# Altium schematic sheet Block_Diagram.SchDoc: WİRELESS SECURİTY DETECTOR
size A3; Date: 1/10/2023; CompanyName: ZONGULDAK BÜLENT ECEVİT; Engineer: Alperen ÖZKUL; DocumentNumber: 2; SheetNumber: 2; SheetTotal: 5; FIRST_PROJECT: 1; PAGE_SİZE: *A3
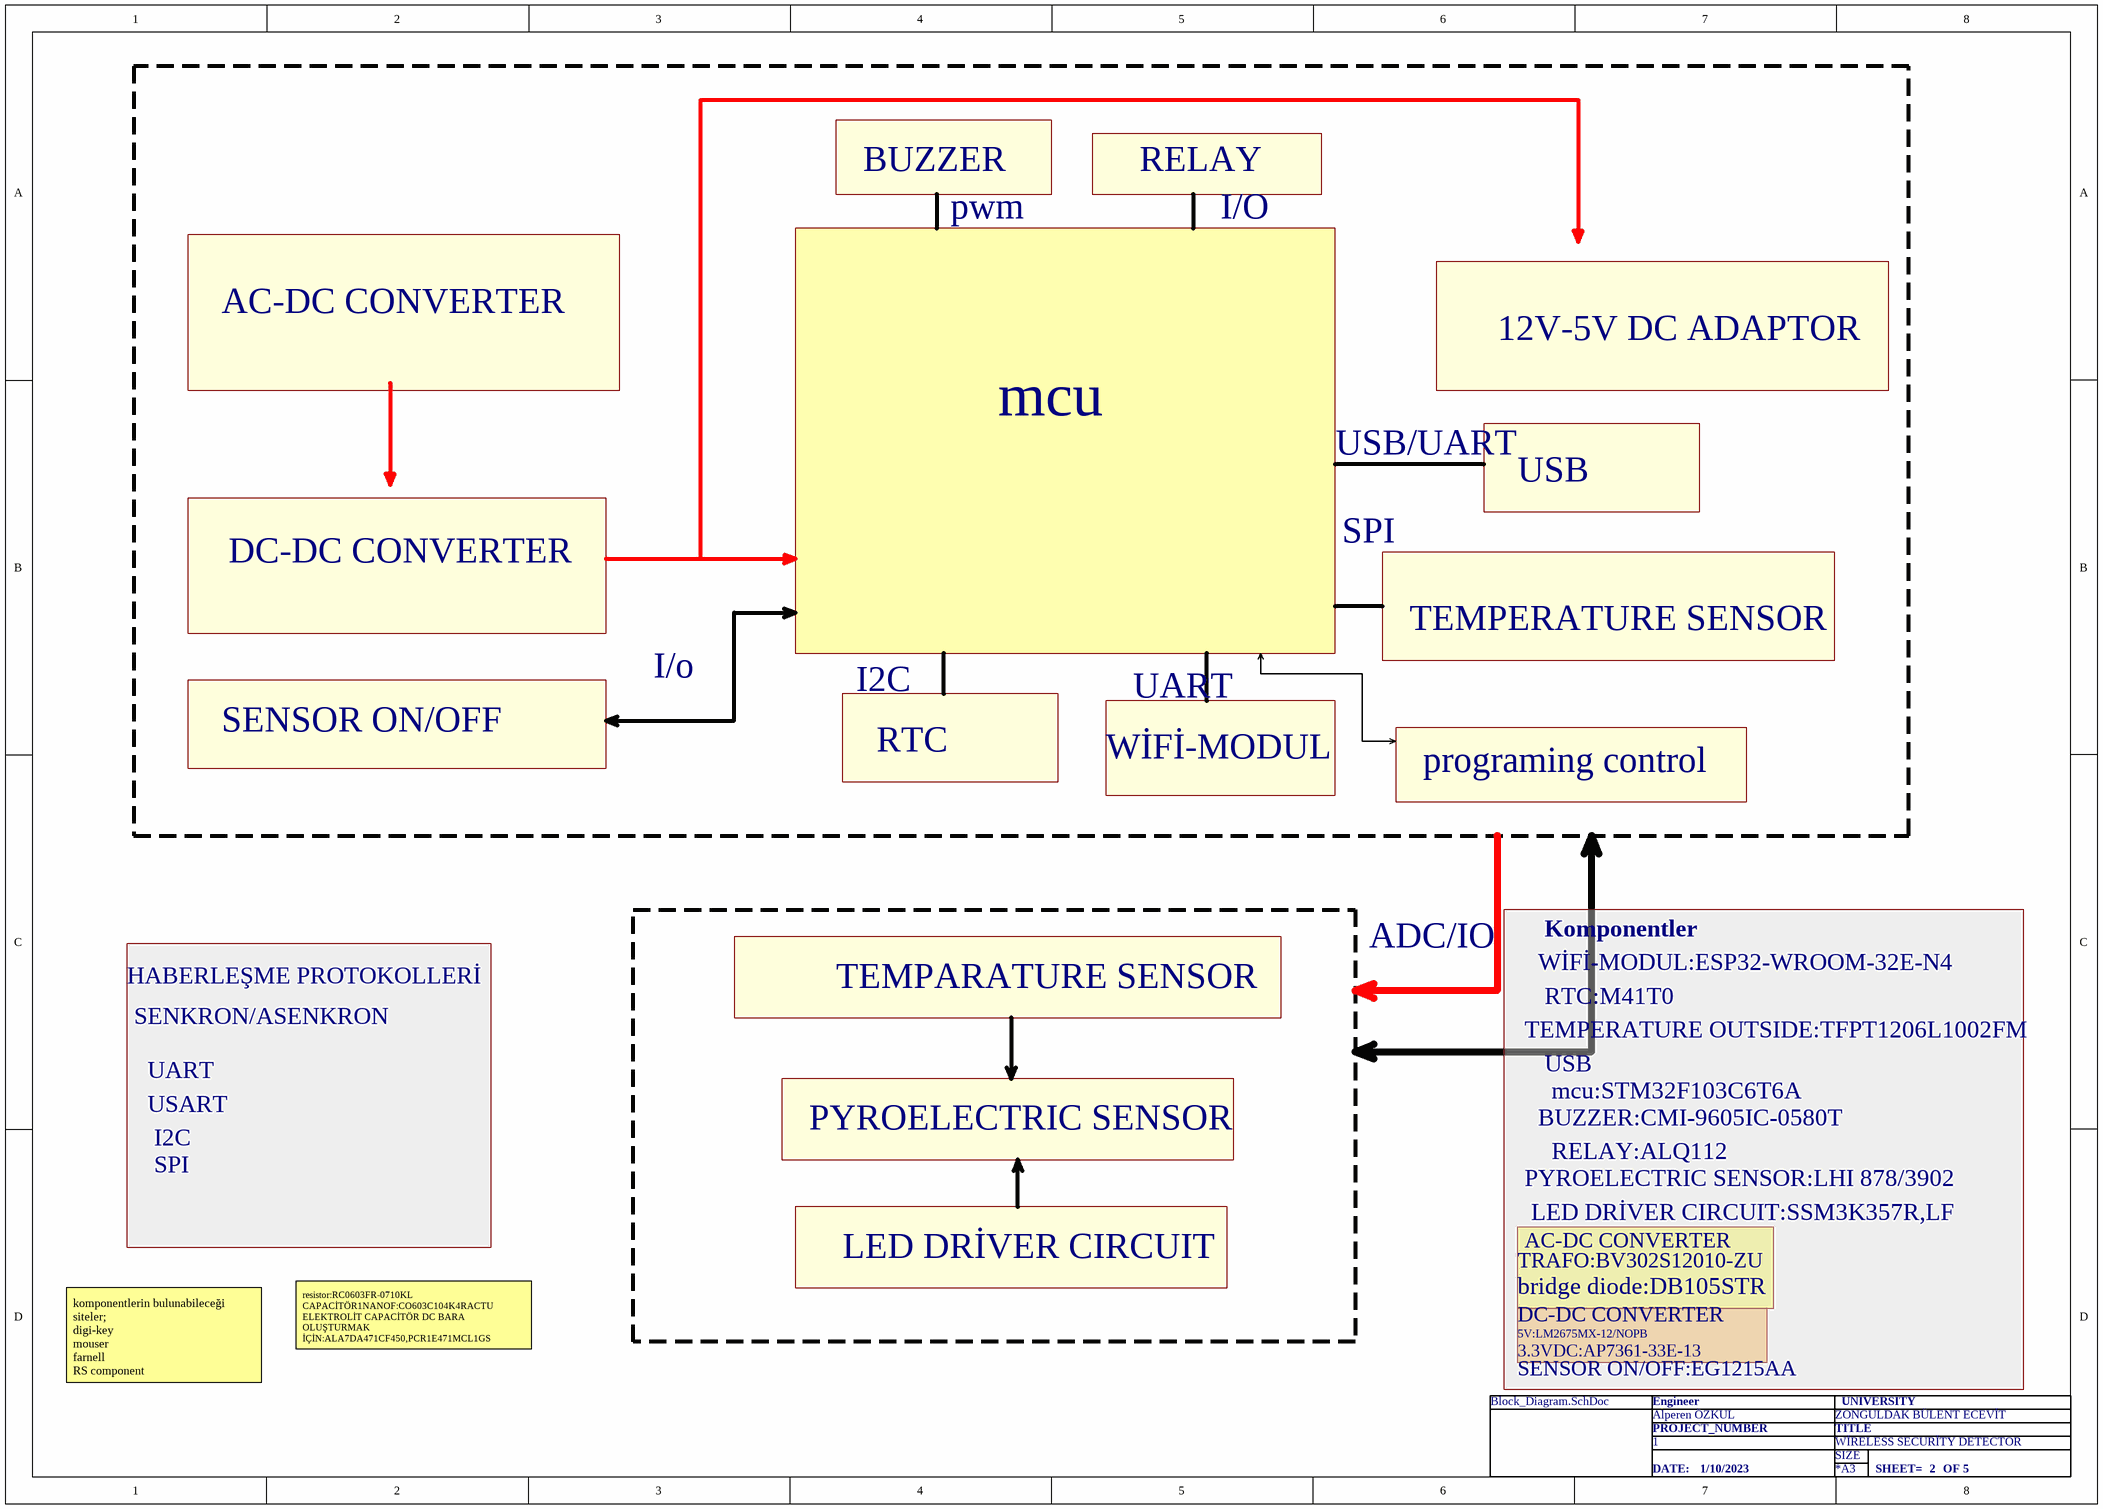
[diagram p0: Block_Diagram.SchDoc]

## Notes on the sheet
- BUZZER
- RELAY
- pwm
- I/O
- AC-DC CONVERTER
- 12V-5V DC ADAPTOR
- mcu
- USB/UART
- USB
- DC-DC CONVERTER
- SPI
- TEMPERATURE SENSOR
- I/o
- I2C
- UART
- SENSOR ON/OFF
- RTC
- WİFİ-MODUL
- programing control
- HABERLEŞME PROTOKOLLERİ
- TEMPARATURE SENSOR
- ADC/IO
- WİFİ-MODUL:ESP32-WROOM-32E-N4
- Komponentler
- SENKRON/ASENKRON
- TEMPERATURE OUTSIDE:TFPT1206L1002FM
- RTC:M41T0
- USART
- BUZZER:CMI-9605IC-0580T
- mcu:STM32F103C6T6A
- PYROELECTRIC SENSOR
- PYROELECTRIC SENSOR:LHI 878/3902
- RELAY:ALQ112
- LED DRİVER CIRCUIT
- LED DRİVER CIRCUIT:SSM3K357R,LF
- TRAFO:BV302S12010-ZU
- bridge diode:DB105STR
- komponentlerin bulunabileceği siteler;
  digi-key
  mouser
  farnell
  RS component
  LCSC
- resistor:RC0603FR-0710KL  CAPACİTÖR1NANOF:CO603C104K4RACTU                                 ELEKTROLİT CAPACİTÖR DC BARA OLUŞTURMAK İÇİN:ALA7DA471CF450,PCR1E471MCL1GS
- SENSOR ON/OFF:EG1215AA
- 5V:LM2675MX-12/NOPB
- 3.3VDC:AP7361-33E-13
- Engineer
- PROJECT_NUMBER
- SIZE
- TITLE
- UNIVERSITY
- DATE:
- SHEET=
- OF